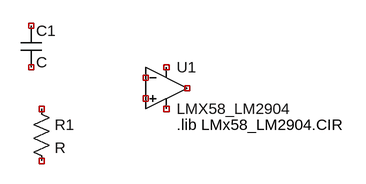
[diagram p0: schematic TapeInput.asc]
TapeInput.asc, the LTspice schematic file:
Version 4
SHEET 1 880 680
SYMBOL Opamps\\opamp2 208 96 R0
SYMATTR InstName U1
SYMATTR Value LMX58_LM2904
SYMBOL res 0 176 R0
SYMATTR InstName R1
SYMBOL cap -16 64 R0
SYMATTR InstName C1
TEXT 224 216 Left 2 !.lib LMx58_LM2904.CIR

The netlist it stands for:
* TapeInput.asc
XU1 NC_01 NC_02 NC_03 NC_04 NC_05 LMX58_LM2904  ; pins In+ In- V+ V- OUT
R1 NC_06 NC_07 R
C1 NC_08 NC_09 C
.lib LMx58_LM2904.CIR
.backanno
.end